# EasyEDA Pro project OpenHaldexC6-V1.1_2026-01-01.epro, schematic Haldex C6 V1.0

## Sheets
1 Power +USB: Board Name: Haldex C6 V1.0; Create Date: 2025-11-26; Page Name: Power +USB; Project Name: OpenHaldexC6-V1.1; Schematic Name: Haldex C6 V1.0; Update Date: 2025-11-27; Company: EasyEDA.com; Page Size: A4; Version: V1.0
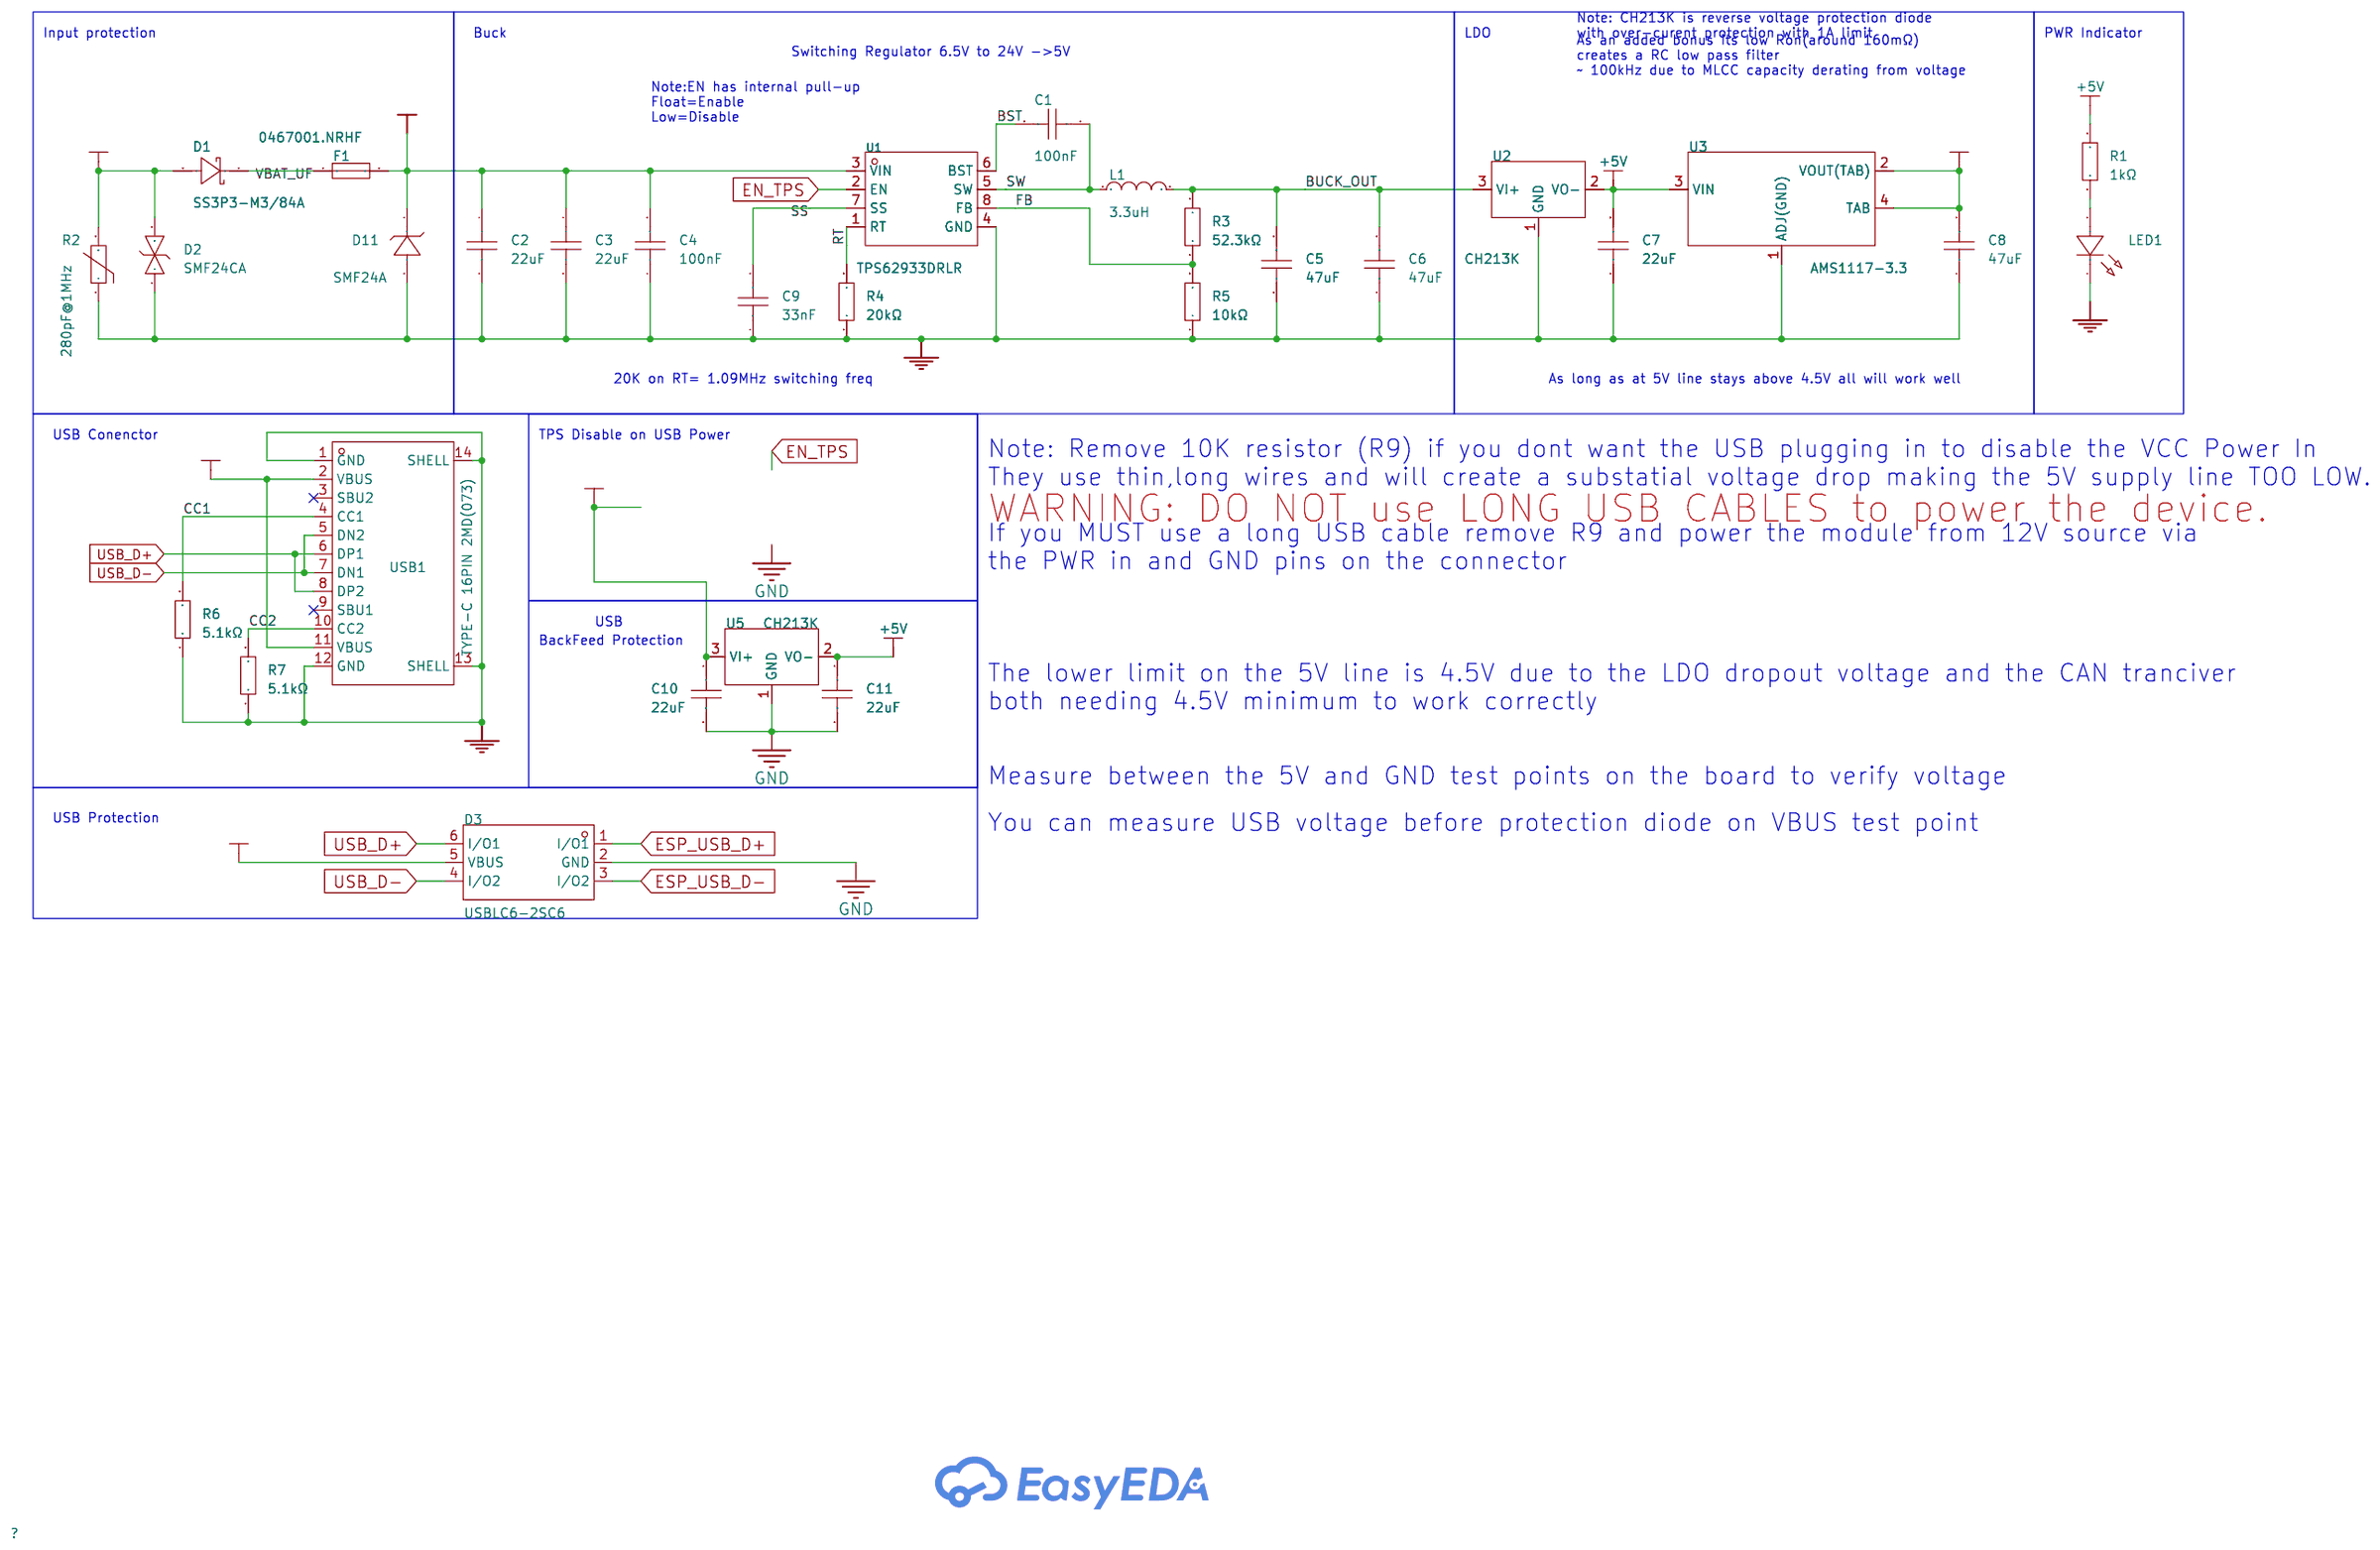
[diagram p0: Power +USB]
2 Conn, Input + Output: Page Name: Conn, Input + Output
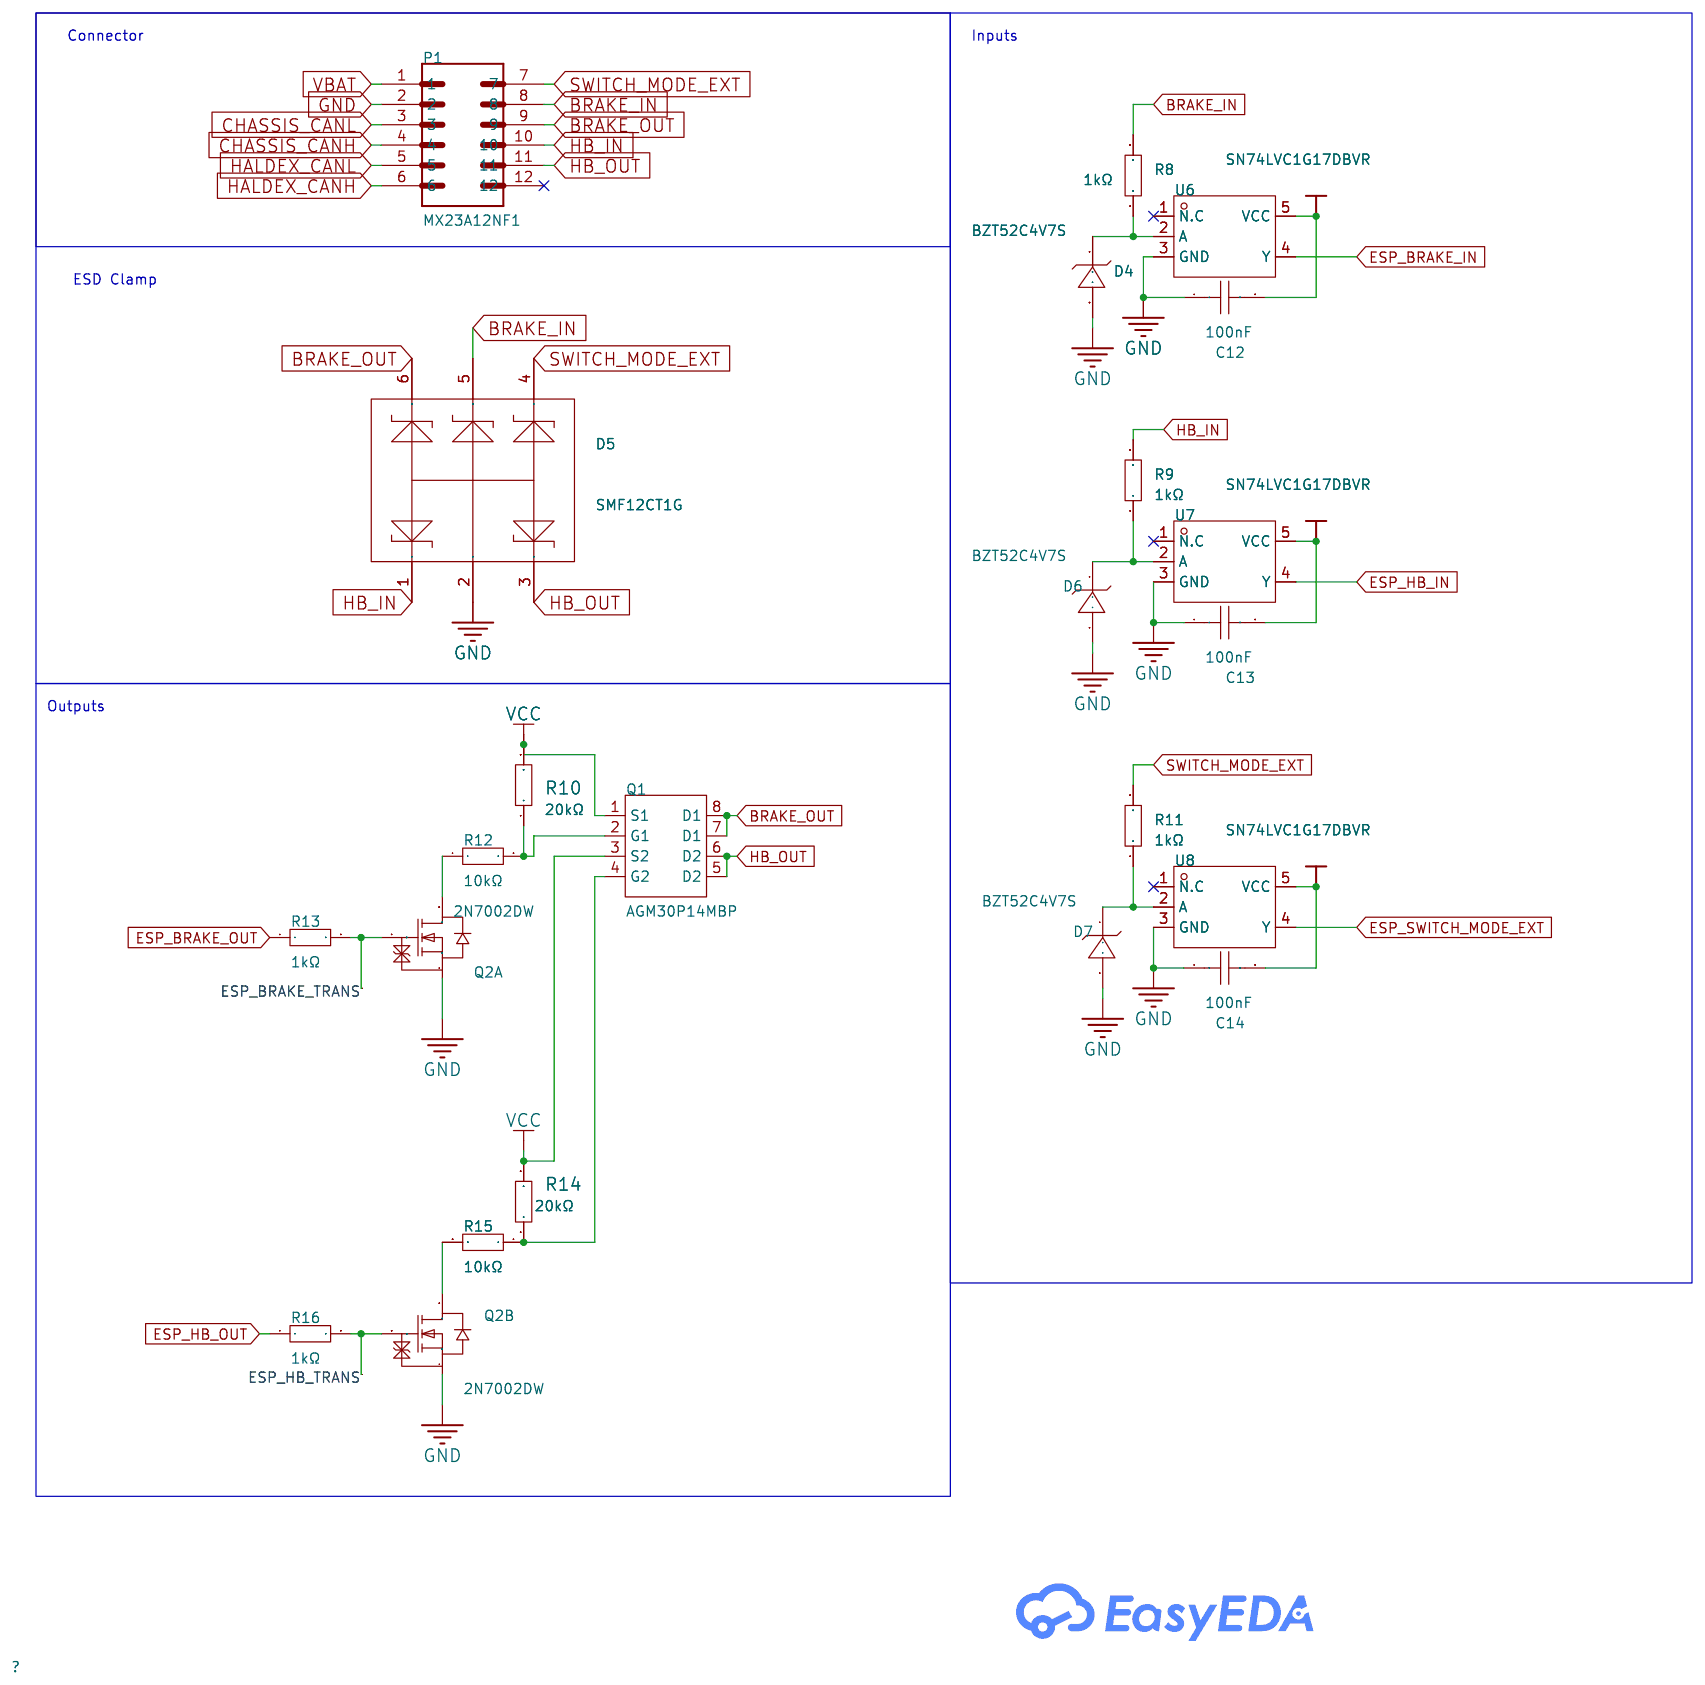
[diagram p1: Conn, Input + Output]
3 MCU + CANBUS: Page Name: MCU + CANBUS
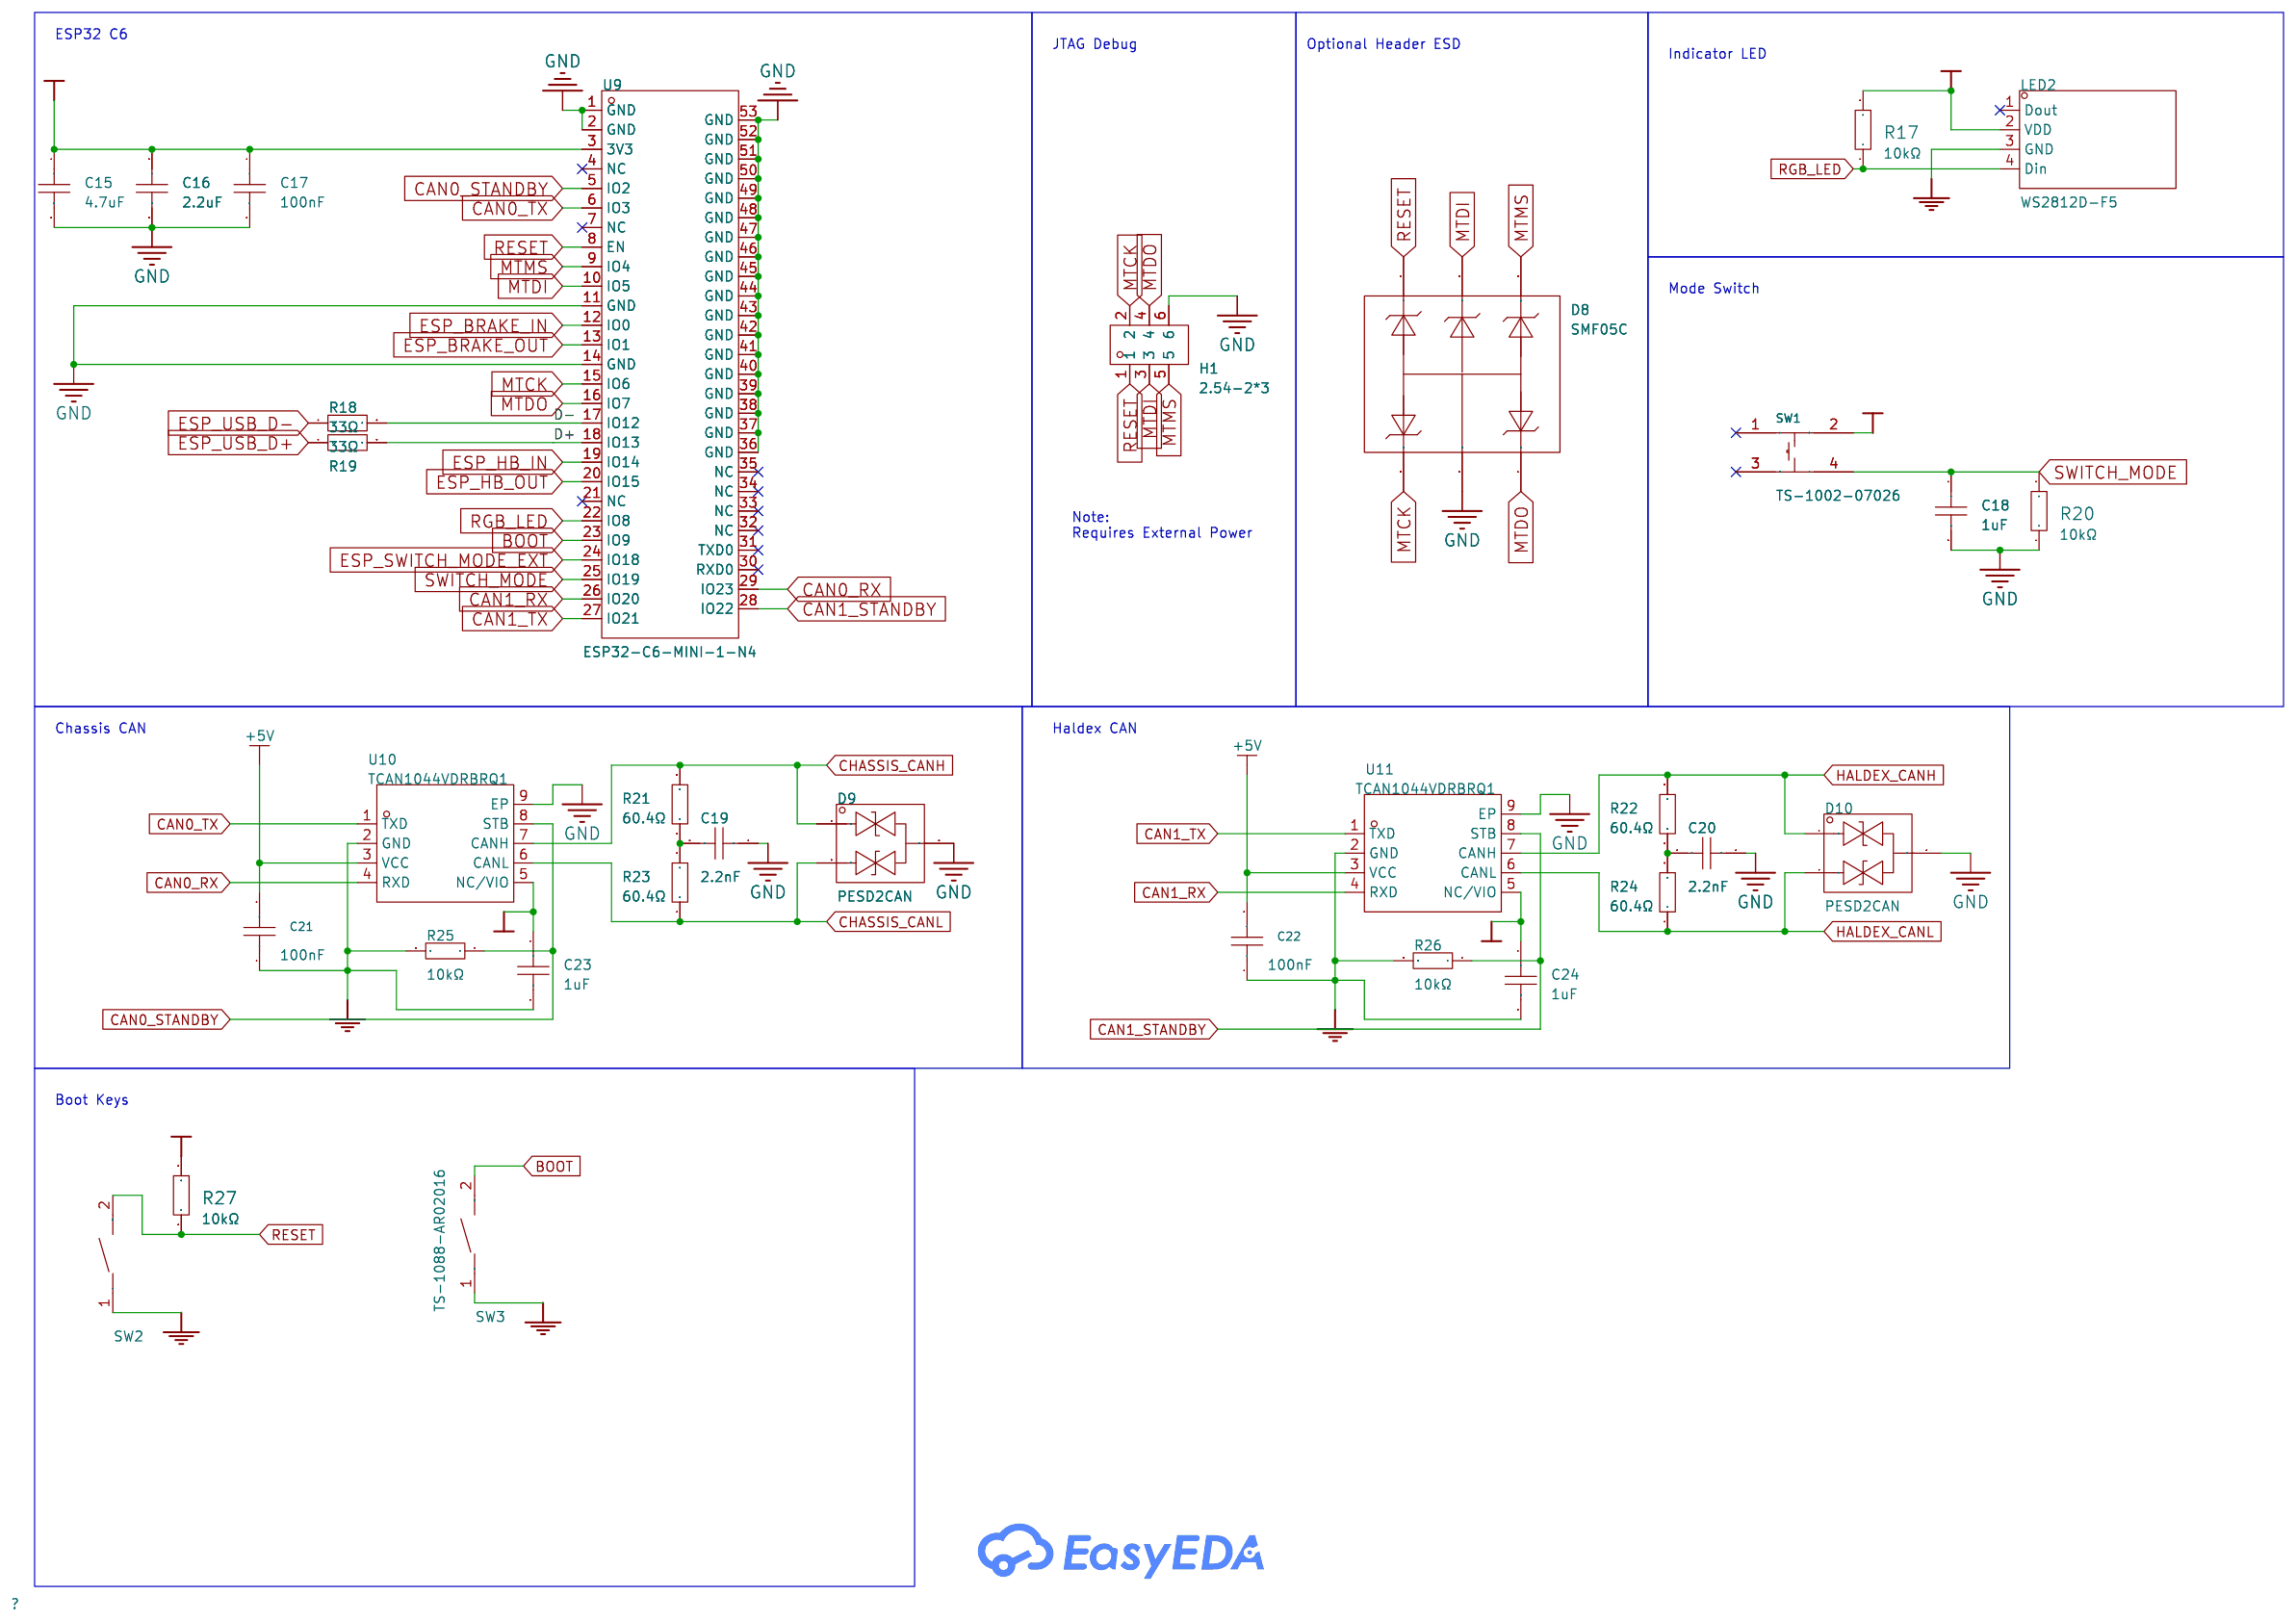
[diagram p2: MCU + CANBUS]

## Parts
sheet Conn, Input + Output
C12  100nF  [C0603]
C13  100nF  [C0603]
C14  100nF  [C0603]
D4  BZT52C4V7S  [SOD-323_L1.8-W1.3-LS2.5-RD]
D5  SMF12CT1G  [SOT-363_L2.0-W1.3-P0.65-LS2.1-BR]
D6  BZT52C4V7S  [SOD-323_L1.8-W1.3-LS2.5-RD]
D7  BZT52C4V7S  [SOD-323_L1.8-W1.3-LS2.5-RD]
P1  MX23A12NF1  [COON-TH_MX23A12NF1]
Q1  AGM30P14MBP  [DFN-8_L3.2-W3.1-P0.65-LS3.4-BL-1]
Q2  2N7002DW  [SOT-363-6_L2.0-W1.3-P0.65-LS2.1-BL]  (sections 1,2)
R8  1kΩ  [R0603]
R9  1kΩ  [R0603]
R10  20kΩ  [R0603]
R11  1kΩ  [R0603]
R12  10kΩ  [R0603]
R13  1kΩ  [R0603]
R14  20kΩ  [R0603]
R15  10kΩ  [R0603]
R16  1kΩ  [R0603]
U6  SN74LVC1G17DBVR  [SOT-23-5_L3.0-W1.5-P0.95-LS2.8-BL]
U7  SN74LVC1G17DBVR  [SOT-23-5_L3.0-W1.5-P0.95-LS2.8-BL]
U8  SN74LVC1G17DBVR  [SOT-23-5_L3.0-W1.5-P0.95-LS2.8-BL]
sheet MCU + CANBUS
C15  4.7uF  [C0603]
C16  2.2uF  [C0603]
C17  100nF  [C0603]
C18  1uF  [C0603]
C19  2.2nF  [C0603]
C20  2.2nF  [C0603]
C21  100nF  [C0603]
C22  100nF  [C0603]
C23  1uF  [C0603]
C24  1uF  [C0603]
D8  SMF05C  [SC-70-6_L2.0-W1.3-P0.65-LS2.1-BR]
D9  PESD2CAN  [SOT-23-3_L2.9-W1.3-P1.90-LS2.4-BR]
D10  PESD2CAN  [SOT-23-3_L2.9-W1.3-P1.90-LS2.4-BR]
H1  2.54-2*3  [HDR-TH_6P-P2.54-V-R2-C3-S2.54_A2541WV-2X3P]
LED2  WS2812D-F5  [LED-TH_4P-BD5.8-P1.30]
R17  10kΩ  [R0603]
R18  33Ω  [R0603]
R19  33Ω  [R0603]
R20  10kΩ  [R0603]
R21  60.4Ω  [R0603]
R22  60.4Ω  [R0603]
R23  60.4Ω  [R0603]
R24  60.4Ω  [R0603]
R25  10kΩ  [R0603]
R26  10kΩ  [R0603]
R27  10kΩ  [R0603]
SW1  TS-1002-07026  [SW-TH_4P-L6.0-W6.0-P4.50-LS6.5]
SW2  TS-1088-AR02016  [SW-SMD_L3.9-W3.0-P4.45]
SW3  TS-1088-AR02016  [SW-SMD_L3.9-W3.0-P4.45]
U9  ESP32-C6-MINI-1-N4  [WIFIM-SMD_61P-L16.6-W13.2-P0.80-ESP32-C6-MINI-1-N4]
U10  TCAN1044VDRBRQ1  [VSON-8_L3.0-W3.0-P0.65-BR-EP]
U11  TCAN1044VDRBRQ1  [VSON-8_L3.0-W3.0-P0.65-BR-EP]
sheet Power +USB
C1  100nF  [C0603]
C2  22uF  [C0805]
C3  22uF  [C0805]
C4  100nF  [C0603]
C5  47uF  [C0805]
C6  47uF  [C0805]
C7  22uF  [C0805]
C8  47uF  [C0805]
C9  33nF  [C0603]
C10  22uF  [C0805]
C11  22uF  [C0805]
D1  SS3P3-M3/84A  [DO-220AA_L3.4-W2.0-LS3.9-RD]
D2  SMF24CA  [SOD-123FL_L2.8-W1.8-LS3.7-BI]
D3  USBLC6-2SC6  [SOT-23-6_L2.9-W1.6-P0.95-LS2.8-BL]
D11  SMF24A  [SOD-123FL_L2.7-W1.8-LS3.8-RD]
F1  0467001.NRHF  [F0603]
L1  3.3uH  [IND-SMD_L5.4-W5.2_RS0530]
LED1  XL-1608UGC-04  [LED0603-RD_GREEN]
R1  1kΩ  [R0603]
R2  280pF@1MHz  [R0805]
R3  52.3kΩ  [R0603]
R4  20kΩ  [R0603]
R5  10kΩ  [R0603]
R6  5.1kΩ  [R0603]
R7  5.1kΩ  [R0603]
U1  TPS62933DRLR  [SOT-583-8_L2.1-W1.2-P0.50-LS1.6-BR]
U2  CH213K  [SOT-23-3_L2.9-W1.6-P1.90-LS2.8-BR]
U3  AMS1117-3.3  [SOT-223-4_L6.5-W3.5-P2.30-LS7.0-BR]
U5  CH213K  [SOT-23-3_L2.9-W1.6-P1.90-LS2.8-BR]
USB1  TYPE-C 16PIN 2MD(073)  [USB-C-SMD_TYPE-C-6PIN-2MD-073]

## Library data of the parts
C1 C4 C12-C14 C17 C21 C22 = CL10B104KB8NNNC: Capacitance:100nF Tolerance:±10% Tolerance:±10% Voltage Rating:50V Temperature Coefficient:X7R; LCSC Part Name: 100nF ±10% 50V; Supplier Part: C1591; Manufacturer: SAMSUNG(三星); Supplier Footprint: 0603; JLCPCB Part Class: Extended Part; Datasheet: https://item.szlcsc.com/datasheet/CL10B104KB8NNNC/1943.html; Supplier: LCSC; Tolerance: ±10%; Voltage Rating: 50V; Temperature Coefficient: X7R
D4 D6 D7 = BZT52C4V7S_C353517: Diode Configuration:Independent Zener Voltage(Nom):4.7V Reverse Leakage Current (Ir):3uA@2V Zener Voltage(Range):4.4V~5V Zener Voltage(Range):4.4V~5V Pd - Power Dissipation:200mW Impedance(Zzt):80Ω Operating Junction Temperature Range:-55℃~+150℃ Operating; LCSC Part Name: 独立式 耐压:4.7V 电流:3uA@2V; Supplier Part: C353517; Manufacturer: 晶导微电子; Supplier Footprint: SOD-323; JLCPCB Part Class: Extended Part; Datasheet: https://item.szlcsc.com/datasheet/BZT52C4V7S/329266.html; Supplier: LCSC; Diode Configuration: Independent; Zener Voltage(Nom): 4.7V; Reverse Leakage Current (Ir): 3uA@2V; Zener Voltage(Range): 4.4V~5V; Pd - Power Dissipation: 200mW; Impedance(Zzt): 80Ω; Operating Junction Temperature Range: -55℃~+150℃
D5 = SMF12CT1G_1: Reverse Stand-Off Voltage (Vrwm):12V Clamping Voltage:28V Peak Pulse Current (Ipp):5A@8/20us Peak Pulse Power Dissipation (Ppp):150W@8/20us Voltage - Breakdown:13.5V Reverse Leakage Current (Ir):100nA Number of Channels:5 level of protection:IEC 61000-4-4; LCSC Part Name: 12V截止 峰值浪涌电流：5A@8/20us; Supplier Part: C2999118; Manufacturer: TECH PUBLIC(台舟); Supplier Footprint: SOT-363; JLCPCB Part Class: Extended Part; Datasheet: https://item.szlcsc.com/datasheet/SMF12CT1G/3475165.html; Supplier: LCSC; Reverse Stand-Off Voltage (Vrwm): 12V; Clamping Voltage: 28V; Peak Pulse Current (Ipp): 5A@8/20us; Peak Pulse Power Dissipation (Ppp): 150W@8/20us; Voltage - Breakdown: 13.5V; Reverse Leakage Current (Ir): 100nA; Number of Channels: 5; level of protection: IEC 61000-4-4；IEC 61000-4-5；IEC 61000-4-2; Junction Capacitance: 20pF
P1 = MX23A12NF1: Supplier Part: C5359486; Manufacturer: JAE(日本航空电子); JLCPCB Part Class: Extended Part; Datasheet: https://atta.szlcsc.com/upload/public/pdf/source/20230330/B7F7CF0886F51BD2154D3E2774694052.pdf; Supplier: LCSC
Q1 = AGM30P14MBP: Number:2 P-Channel Drain to Source Voltage:30V Current - Continuous Drain(Id):21A RDS(on):12.3mΩ@10V Pd - Power Dissipation:30W Gate Threshold Voltage (Vgs(th)):1.5V@250uA Gate Charge(Qg):14nC@10V Input Capacitance(Ciss):1.35nF Reverse Transfer Capacitanc; LCSC Part Name: 2个P沟道 耐压:30V 电流:21A; Supplier Part: C5367089; Manufacturer: AGMSEMI(芯控源); Supplier Footprint: PDFN-8(3.3x3.3); JLCPCB Part Class: Extended Part; Datasheet: https://item.szlcsc.com/datasheet/AGM30P14MBP/6204015.html; Supplier: LCSC; Number: 2 P-Channel; Drain to Source Voltage: 30V; Current - Continuous Drain(Id): 21A; RDS(on): 12.3mΩ@10V; Pd - Power Dissipation: 30W; Gate Threshold Voltage (Vgs(th)): 1.5V@250uA; Gate Charge(Qg): 14nC@10V; Input Capacitance(Ciss): 1.35nF; Reverse Transfer Capacitance (Crss@Vds): 158pF; Operating Temperature: -55℃~+150℃; Output Capacitance(Coss): 194pF
Q2 = 2N7002DW_C5190214: Number:2 N-Channel Drain to Source Voltage:60V Current - Continuous Drain(Id):300mA RDS(on):1.9Ω@10V,0.3A Pd - Power Dissipation:300mW Gate Threshold Voltage (Vgs(th)):2.5V Gate Charge(Qg):650pC@30V Input Capacitance(Ciss):12pF@30V Reverse Transfer Capaci; LCSC Part Name: 双N沟道,电流:300mA,耐压:60V; Supplier Part: C5190214; Manufacturer: Hottech(合科泰); Supplier Footprint: SOT-363; Datasheet: https://item.szlcsc.com/datasheet/2N7002DW/5870820.html; Supplier: LCSC; Number: 2 N-Channel; Drain to Source Voltage: 60V; Current - Continuous Drain(Id): 300mA; RDS(on): 1.9Ω@10V,0.3A; Pd - Power Dissipation: 300mW; Gate Threshold Voltage (Vgs(th)): 2.5V; Gate Charge(Qg): 650pC@30V; Input Capacitance(Ciss): 12pF@30V; Operating Temperature: -50℃~+150℃
R8 R9 R11 = 0603WAF1001T5E: Type:Thick Film Resistors Resistance:1kΩ Tolerance:±1% Tolerance:±1% Power(Watts): Overload Voltage (Max): Temperature Coefficient:±100ppm/℃ Temperature Coefficient:±100ppm/℃ Operating Temperature Range:-55℃~+155℃ Operating Temperature Range:-55℃~+155℃; LCSC Part Name: 1kΩ ±1% 100mW 厚膜电阻; Supplier Part: C21190; Manufacturer: UNI-ROYAL(厚声); Supplier Footprint: 0603; JLCPCB Part Class: Basic Part; Datasheet: https://atta.szlcsc.com/upload/public/pdf/source/20200306/C422600_1E6D84923E4A46A82E41ADD87F860B5C.pdf; Supplier: LCSC; Type: Thick Film Resistors; Tolerance: ±1%; Temperature Coefficient: ±100ppm/℃; Operating Temperature Range: -55℃~+155℃; Check: true
R4 R10 R14 = 0603WAF2002T5E: Type:Thick Film Resistor Resistance:20kΩ Tolerance:±1% Tolerance:±1% Power(Watts):100mW Voltage-Supply(Max):75V Temperature Coefficient:±100ppm/℃ Temperature Coefficient:±100ppm/℃ Operating Temperature:-55℃~+155℃ Operating Temperature:-55℃~+155℃; LCSC Part Name: 20kΩ ±1% 100mW 厚膜电阻; Supplier Part: C4184; Manufacturer: UNI-ROYAL(厚声); Supplier Footprint: 0603; JLCPCB Part Class: Basic Part; Datasheet: https://item.szlcsc.com/datasheet/0603WAF2002T5E/4591.html; Supplier: LCSC; Type: Thick Film Resistor; Tolerance: ±1%; Power(Watts): 100mW; Voltage-Supply(Max): 75V; Temperature Coefficient: ±100ppm/℃; Operating Temperature: -55℃~+155℃
R5 R12 R15 R25 R26 = 0603WAF1002T5E: Type:Thick Film Resistor Resistance:10kΩ Tolerance:±1% Tolerance:±1% Power(Watts):100mW Voltage-Supply(Max):75V Temperature Coefficient:±100ppm/℃ Temperature Coefficient:±100ppm/℃ Operating Temperature:-55℃~+155℃ Operating Temperature:-55℃~+155℃; LCSC Part Name: 厚膜电阻 10kΩ ±1% 100mW; Supplier Part: C25804; Manufacturer: UNI-ROYAL(厚声); Supplier Footprint: 0603; JLCPCB Part Class: Basic Part; Datasheet: https://item.szlcsc.com/datasheet/0603WAF1002T5E/26547.html; Supplier: LCSC; Type: Thick Film Resistor; Tolerance: ±1%; Power(Watts): 100mW; Voltage-Supply(Max): 75V; Temperature Coefficient: ±100ppm/℃; Operating Temperature: -55℃~+155℃
R1 R13 R16 = 0603WAF1001T5E: Type:Thick Film Resistors Resistance:1kΩ Tolerance:±1% Tolerance:±1% Power(Watts): Overload Voltage (Max): Temperature Coefficient:±100ppm/℃ Temperature Coefficient:±100ppm/℃ Operating Temperature Range:-55℃~+155℃ Operating Temperature Range:-55℃~+155℃; LCSC Part Name: 1kΩ ±1% 100mW 厚膜电阻; Supplier Part: C21190; Manufacturer: UNI-ROYAL(厚声); Supplier Footprint: 0603; JLCPCB Part Class: Basic Part; Datasheet: https://atta.szlcsc.com/upload/public/pdf/source/20200306/C422600_1E6D84923E4A46A82E41ADD87F860B5C.pdf; Supplier: LCSC; Type: Thick Film Resistors; Tolerance: ±1%; Temperature Coefficient: ±100ppm/℃; Operating Temperature Range: -55℃~+155℃
U6-U8 = SN74LVC1G17DBVR_C19829662: Supplier Part: C19829662; Manufacturer: TECH PUBLIC(台舟); Supplier Footprint: SOT-23-5; JLCPCB Part Class: Extended Part; Datasheet: https://atta.szlcsc.com/upload/public/pdf/source/20240202/EAF8B4F29332307745EEFE11873F995E.pdf; Supplier: LCSC
C15 = CL10A475KP8NNNC: Capacitance:4.7uF Tolerance:±10% Tolerance:±10% Voltage Rating:10V Temperature Coefficient:X5R; LCSC Part Name: 4.7uF ±10% 10V; Supplier Part: C1705; Manufacturer: SAMSUNG(三星); Supplier Footprint: 0603; JLCPCB Part Class: Extended Part; Datasheet: https://item.szlcsc.com/datasheet/CL10A475KP8NNNC/2057.html; Supplier: LCSC; Tolerance: ±10%; Voltage Rating: 10V; Temperature Coefficient: X5R
C16 = CL10A225KO8NNNC: Capacitance:2.2uF Tolerance:±10% Tolerance:±10% Voltage Rating:16V Temperature Coefficient:X5R; LCSC Part Name: 2.2uF ±10% 16V; Supplier Part: C23630; Manufacturer: SAMSUNG(三星); Supplier Footprint: 0603; JLCPCB Part Class: Basic Part; Datasheet: https://item.szlcsc.com/datasheet/CL10A225KO8NNNC/24366.html; Supplier: LCSC; Tolerance: ±10%; Voltage Rating: 16V; Temperature Coefficient: X5R
C18 C23 C24 = CL10B105KB8NQNC: Capacitance:1uF Tolerance:±10% Tolerance:±10% Voltage Rating:50V Temperature Coefficient:X7R; LCSC Part Name: 1uF ±10% 50V; Supplier Part: C5199872; Manufacturer: SAMSUNG(三星); Supplier Footprint: 0603; JLCPCB Part Class: Extended Part; Datasheet: https://item.szlcsc.com/datasheet/CL10B105KB8NQNC/5885909.html; Supplier: LCSC; Tolerance: ±10%; Voltage Rating: 50V; Temperature Coefficient: X7R
C19 C20 = CL10C222JB8NNNC: Capacitance:2.2nF Tolerance:±5% Tolerance:±5% Voltage Rating:50V Temperature Coefficient:C0G; LCSC Part Name: 2.2nF ±5% 50V; Supplier Part: C33353; Manufacturer: SAMSUNG(三星); Supplier Footprint: 0603; JLCPCB Part Class: Extended Part; Datasheet: https://item.szlcsc.com/datasheet/CL10C222JB8NNNC/34318.html; Supplier: LCSC; Tolerance: ±5%; Voltage Rating: 50V; Temperature Coefficient: C0G
D8 = SMF05C_C558425: Polarity:Unidirectional Reverse Stand-Off Voltage (Vrwm):5V Clamping Voltage:12V Peak Pulse Current (Ipp):10A@8/20us Peak Pulse Power Dissipation (Ppp):200W@8/20us Voltage - Breakdown:6V Reverse Leakage Current (Ir):100nA Number of Channels:5 Operating Te; LCSC Part Name: MSL=3; Supplier Part: C558425; Manufacturer: TECH PUBLIC(台舟); Supplier Footprint: SOT-363; JLCPCB Part Class: Extended Part; Datasheet: https://item.szlcsc.com/datasheet/SMF05C/581832.html; Supplier: LCSC; Polarity: Unidirectional; Reverse Stand-Off Voltage (Vrwm): 5V; Clamping Voltage: 12V; Peak Pulse Current (Ipp): 10A@8/20us; Peak Pulse Power Dissipation (Ppp): 200W@8/20us; Voltage - Breakdown: 6V; Reverse Leakage Current (Ir): 100nA; Number of Channels: 5; Operating Temperature: -55℃~+125℃; level of protection: IEC 61000-4-2；IEC 61000-4-4；IEC 61000-4-5; Type: ESD; Junction Capacitance: 80pF
D9 D10 = PESD2CAN: Reverse Stand-Off Voltage (Vrwm):24V Clamping Voltage:54V Peak Pulse Current (Ipp):8A@8/20us Voltage - Breakdown:26.7V Type:TVS; Supplier Part: C284078; Manufacturer: DOWO(东沃); Supplier Footprint: SOT-23; JLCPCB Part Class: Extended Part; Datasheet: https://item.szlcsc.com/datasheet/PESD2CAN/269579.html; Supplier: LCSC; Reverse Stand-Off Voltage (Vrwm): 24V; Clamping Voltage: 54V; Peak Pulse Current (Ipp): 8A@8/20us; Voltage - Breakdown: 26.7V; Type: TVS
H1 = 2.54-2*3: Pin Structure:2x3P Pitch:2.54mm Row Spacing:2.54mm Circluar Pins/Square Pins:Pin Header Mounting Type:Through Hole Number of Rows:2 Number of Pins:6P Current Rating:2.5A Length of Mating Pin:6mm Insulation Height:2.54mm Length of End Connection Pin:3mm Co; LCSC Part Name: 2x3P 间距:2.54mm 方针 直插; Supplier Part: C5116479; Manufacturer: ZHOURI(洲日); Supplier Footprint: 插件,P=2.54mm; JLCPCB Part Class: Extended Part; Datasheet: https://item.szlcsc.com/datasheet/2.54-2*3/5692722.html; Supplier: LCSC; Pin Structure: 2x3P; Pitch: 2.54mm; Row Spacing: 2.54mm; Circluar Pins/Square Pins: Pin Header; Mounting Type: Through Hole; Number of Rows: 2; Number of Pins: 6P; Current Rating: 2.5A; Length of Mating Pin: 6mm; Insulation Height: 2.54mm; Length of End Connection Pin: 3mm; Contact Material: Brass; Contact Plating: Gold; Operating Temperature: -40℃~+105℃
LED2 = WS2812D-F5: Wavelength:R:620nm~625nm；B:465nm~470nm；G:520nm~525nm Luminous Intensity:G:4000mcd；R:3000mcd；B:2500mcd Fixed-Frequency Pwm Mode:2kHz Data Transmission Rate:800Kbit/s Voltage - Supply:3.7V~5.3V Voltage - Supply:3.7V~5.3V Operating Temperature:-25℃~+85℃ Peak; LCSC Part Name: 智能控制通孔式LED集成光源; Supplier Part: C190565; Manufacturer: worldsemi; Supplier Footprint: 插件,D=5mm; JLCPCB Part Class: Extended Part; Datasheet: https://item.szlcsc.com/datasheet/WS2812D-F5/211094.html; Supplier: LCSC; Wavelength: R:620nm~625nm；B:465nm~470nm；G:520nm~525nm; Luminous Intensity: G:4000mcd；R:3000mcd；B:2500mcd; Fixed-Frequency Pwm Mode: 2kHz; Data Transmission Rate: 800Kbit/s; Voltage - Supply: 3.7V~5.3V; Operating Temperature: -25℃~+85℃; Peak Wavelength: G:522.5nm；R:622.5nm；B:467.5nm
R17 R20 R27 = 0603WAF1002T5E: Type:Thick Film Resistor Resistance:10kΩ Tolerance:±1% Tolerance:±1% Power(Watts):100mW Voltage-Supply(Max):75V Temperature Coefficient:±100ppm/℃ Temperature Coefficient:±100ppm/℃ Operating Temperature:-55℃~+155℃ Operating Temperature:-55℃~+155℃; LCSC Part Name: 厚膜电阻 10kΩ ±1% 100mW; Supplier Part: C25804; Manufacturer: UNI-ROYAL(厚声); Supplier Footprint: 0603; JLCPCB Part Class: Basic Part; Datasheet: https://atta.szlcsc.com/upload/public/pdf/source/20200306/C422600_1E6D84923E4A46A82E41ADD87F860B5C.pdf; Supplier: LCSC; Type: Thick Film Resistor; Tolerance: ±1%; Power(Watts): 100mW; Voltage-Supply(Max): 75V; Temperature Coefficient: ±100ppm/℃; Operating Temperature: -55℃~+155℃
R18 R19 = 0603WAF330JT5E: Type:Thick Film Resistor Resistance:33Ω Tolerance:±1% Tolerance:±1% Power(Watts):100mW Voltage-Supply(Max):75V Temperature Coefficient:±100ppm/℃ Temperature Coefficient:±100ppm/℃ Operating Temperature:-55℃~+155℃ Operating Temperature:-55℃~+155℃; LCSC Part Name: 33Ω ±1% 100mW 厚膜电阻; Supplier Part: C23140; Manufacturer: UNI-ROYAL(厚声); Supplier Footprint: 0603; JLCPCB Part Class: Basic Part; Datasheet: https://item.szlcsc.com/datasheet/0603WAF330JT5E/23867.html; Supplier: LCSC; Type: Thick Film Resistor; Tolerance: ±1%; Power(Watts): 100mW; Voltage-Supply(Max): 75V; Temperature Coefficient: ±100ppm/℃; Operating Temperature: -55℃~+155℃
R21-R24 = RC0603FR-0760R4L: Type:Thick Film Resistors Resistance: Tolerance:±1% Tolerance:±1% Power(Watts): Overload Voltage (Max): Temperature Coefficient:±100ppm/℃ Temperature Coefficient:±100ppm/℃ Operating Temperature Range:-55℃~+155℃ Operating Temperature Range:-55℃~+155℃; LCSC Part Name: 厚膜电阻 60.4Ω ±1% 100mW; Supplier Part: C245987; Manufacturer: YAGEO(国巨); Supplier Footprint: 0603; JLCPCB Part Class: Extended Part; Datasheet: https://atta.szlcsc.com/upload/public/pdf/source/20180821/C275644_0D56F95EFF785E7D9A1FEF436B37DA78.pdf; Supplier: LCSC; Type: Thick Film Resistors; Tolerance: ±1%; Temperature Coefficient: ±100ppm/℃; Operating Temperature Range: -55℃~+155℃
SW1 = TS-1002-07026: Circuit:SPST Actuator Style:Round Button Mounting Type:Through Hole Length:6mm Width:6mm Switch Height:7mm Contact Current:50mA Voltage Rating:12V With Lamp:- Life:-; LCSC Part Name: 6*6*7mm 直插 轻触开关; Supplier Part: C455095; Manufacturer: XUNPU(讯普); Supplier Footprint: 插件,6x6mm; JLCPCB Part Class: Extended Part; Datasheet: https://item.szlcsc.com/datasheet/TS-1002-07026/457500.html; Supplier: LCSC; Circuit: SPST; Actuator Style: Round Button; Mounting Type: Through Hole; Length: 6mm; Width: 6mm; Switch Height: 7mm; Contact Current: 50mA; Voltage Rating: 12V
SW2 SW3 = TS-1088-AR02016: Circuit:SPST Actuator Style:Round Button Operating Force:1.6N Mounting Type:Surface Mount,Vertical Length:4mm Width:3mm Switch Height:2mm with Bracket:Without Bracket Contact Current:50mA Voltage Rating:12V Actuator/Cap Color:Black Termination Style:SMD(S; LCSC Part Name: 4*3*2mm 立贴 轻触开关; Supplier Part: C720477; Manufacturer: XUNPU(讯普); Supplier Footprint: SMD; JLCPCB Part Class: Basic Part; Datasheet: https://item.szlcsc.com/datasheet/TS-1088-AR02016/763484.html; Supplier: LCSC; Circuit: SPST; Actuator Style: Round Button; Operating Force: 1.6N; Mounting Type: Surface Mount,Vertical; Length: 4mm; Width: 3mm; Switch Height: 2mm; with Bracket: Without Bracket; Contact Current: 50mA; Voltage Rating: 12V; Actuator/Cap Color: Black; Termination Style: SMD(SMT) Tab; Life: 100,000 Cycles; Operating Temperature: -30℃~+80℃
U9 = ESP32-C6-MINI-1-N4: Supplier Part: C5736265; Manufacturer: ESPRESSIF(乐鑫); Supplier Footprint: SMD-53P; JLCPCB Part Class: Extended Part; Datasheet: https://item.szlcsc.com/datasheet/ESP32-C6-MINI-1-N4/6661848.html; Supplier: LCSC
U10 U11 = TCAN1044VDRBRQ1: Type:CAN FD Transceiver Data Rate:8Mbps Voltage - Supply:4.5V~5.5V Voltage - Supply:4.5V~5.5V Operating Temperature:-40℃~+125℃ Operating Temperature:-40℃~+125℃; LCSC Part Name: 具有待机和 1.8V I/O 支持的汽车类故障保护高速 CAN 收发器; Supplier Part: C5215851; Manufacturer: TI(德州仪器); Supplier Footprint: SON-8(3x3); JLCPCB Part Class: Extended Part; Datasheet: https://www.ti.com/cn/lit/gpn/tcan1044v-q1; Supplier: LCSC; Type: CAN FD Transceiver; Data Rate: 8Mbps; Voltage - Supply: 4.5V~5.5V; Operating Temperature: -40℃~+125℃
C2 C3 C7 C10 C11 = HGC0805R5226M350NSLJ: Capacitance: Tolerance:±20% Tolerance:±20% Voltage Rated: Temperature Coefficient:; LCSC Part Name: 22uF ±20% 35V; Supplier Part: C22367832; Manufacturer: Chinocera(华瓷); Supplier Footprint: 0805; JLCPCB Part Class: Extended Part; Datasheet: https://atta.szlcsc.com/upload/public/pdf/source/20240326/E9E9157D170E907C889ABA1F54A94302.pdf; Supplier: LCSC; Tolerance: ±20%; Standardization Check: false
C5 C6 C8 = CL21A476MPYNNWE: Capacitance:47uF Tolerance:±20% Tolerance:±20% Voltage Rating:10V Temperature Coefficient:X5R; LCSC Part Name: 47uF ±20% 10V; Supplier Part: C5596752; Manufacturer: SAMSUNG(三星); Supplier Footprint: 0805; JLCPCB Part Class: Extended Part; Datasheet: https://item.szlcsc.com/datasheet/CL21A476MPYNNWE/6515219.html; Supplier: LCSC; Tolerance: ±20%; Voltage Rating: 10V; Temperature Coefficient: X5R
C9 = CL10B333KB8NNNC: Capacitance:33nF Tolerance:±10% Tolerance:±10% Voltage Rating:50V Temperature Coefficient:X7R; LCSC Part Name: 33nF ±10% 50V; Supplier Part: C21117; Manufacturer: SAMSUNG(三星); Supplier Footprint: 0603; JLCPCB Part Class: Basic Part; Datasheet: https://item.szlcsc.com/datasheet/CL10B333KB8NNNC/21829.html; Supplier: LCSC; Tolerance: ±10%; Voltage Rating: 50V; Temperature Coefficient: X7R
D1 = SS3P3-M3/84A: Diode Configuration:Independent Voltage - Forward(Vf@If):520mV@3A Voltage - DC Reverse(Vr):30V Current - Rectified:3A Reverse Leakage Current (Ir):200uA@30V Operating Junction Temperature Range:-55℃~+150℃ Operating Junction Temperature Range:-55℃~+150℃ No; LCSC Part Name: 电压:30V 电流:3A; Supplier Part: C2920641; Manufacturer: VISHAY(威世); Supplier Footprint: DO-220AA; Datasheet: https://item.szlcsc.com/datasheet/SS3P3-M3%252F84A/3224886.html; Supplier: LCSC; Diode Configuration: Independent; Voltage - Forward(Vf@If): 520mV@3A; Voltage - DC Reverse(Vr): 30V; Current - Rectified: 3A; Reverse Leakage Current (Ir): 200uA@30V; Operating Junction Temperature Range: -55℃~+150℃; Non-Repetitive Peak Forward Surge Current: 50A
D2 = SMF24CA_C353294: Reverse Stand-Off Voltage (Vrwm):24V Maximum Clamping Voltage:38.9V Peak Pulse Current (Ipp)@10/1000us:5.1A Breakdown Voltage:26.7V Reverse Leakage Current (Ir):1uA Type:TVS; Supplier Part: C353294; Manufacturer: 晶导微电子; Supplier Footprint: SOD-123FL; JLCPCB Part Class: Extended Part; Datasheet: https://atta.szlcsc.com/upload/public/pdf/source/20201106/C438024_76561727B84E8C9F41A4B4461A8AA838.pdf; Supplier: LCSC; Reverse Stand-Off Voltage (Vrwm): 24V; Maximum Clamping Voltage: 38.9V; Peak Pulse Current (Ipp)@10/1000us: 5.1A; Breakdown Voltage: 26.7V; Reverse Leakage Current (Ir): 1uA; Type: TVS
D3 = USBLC6-2SC6_C2687116: Maximum Clamping Voltage:15V Breakdown Voltage:6V Number of Lines:双路 Type:ESD; Supplier Part: C2687116; Manufacturer: UMW(友台半导体); Supplier Footprint: SOT-23-6; JLCPCB Part Class: Extended Part; Datasheet: https://atta.szlcsc.com/upload/public/pdf/source/20231109/512642D850D9873E7C519F71E85B9A10.pdf; Supplier: LCSC; Maximum Clamping Voltage: 15V; Breakdown Voltage: 6V; Number of Lines: 双路; Type: ESD
D11 = SMF24A_C19077514: Polarity:Unidirectional Reverse Stand-Off Voltage (Vrwm):24V Clamping Voltage:38.9V Peak Pulse Current (Ipp):5.1A@10/1000us Peak Pulse Power Dissipation (Ppp):200W@10/1000us Voltage - Breakdown:29.5V Reverse Leakage Current (Ir):1uA Number of Channels:1.0; LCSC Part Name: 单向TVS 24V截止 峰值浪涌电流：5.1A@10/1000us; Supplier Part: C19077514; Manufacturer: R+O(宏嘉诚); Supplier Footprint: SOD-123FL; JLCPCB Part Class: Extended Part; Datasheet: https://item.szlcsc.com/datasheet/SMF24A/20275599.html; Supplier: LCSC; Polarity: Unidirectional; Reverse Stand-Off Voltage (Vrwm): 24V; Clamping Voltage: 38.9V; Peak Pulse Current (Ipp): 5.1A@10/1000us; Peak Pulse Power Dissipation (Ppp): 200W@10/1000us; Voltage - Breakdown: 29.5V; Reverse Leakage Current (Ir): 1uA; Number of Channels: 1; Operating Temperature: -55℃~+150℃; level of protection: IEC 61000-4-2; Type: TVS
F1 = 0467001.NRHF: Type:Surface Mount Fuse Current Rating:1A Voltage Rating (AC):32V Voltage Rating (DC):32V Operating Temperature:-55℃~+90℃ Operating Temperature:-55℃~+90℃ Melting I2t:0.0212 Interrupt Rating:50A; LCSC Part Name: 32V贴片式保险丝; Supplier Part: C151139; Manufacturer: Littelfuse(美国力特); Supplier Footprint: 0603; JLCPCB Part Class: Extended Part; Datasheet: https://item.szlcsc.com/datasheet/0467001.NRHF/162479.html; Supplier: LCSC; Type: Surface Mount Fuse; Current Rating: 1A; Voltage Rating (AC): 32V; Voltage Rating (DC): 32V; Operating Temperature: -55℃~+90℃; Melting I2t: 0.0212; Interrupt Rating: 50A
L1 = RS0530-3R3MS: Inductance: Tolerance:±20% Tolerance:±20% Rated Current: Current - Saturation (Isat):6A DC Resistance (DCR): Type:Integrated molded inductor; LCSC Part Name: 一体成型贴片电感; Supplier Part: C32712971; Manufacturer: Ruishen(瑞申电子); Supplier Footprint: SMD,5.4x5.2mm; JLCPCB Part Class: Extended Part; Datasheet: https://atta.szlcsc.com/upload/public/pdf/source/20240725/7B6EBB1A494949AC693F8F7680A8A98C.pdf; Supplier: LCSC; Tolerance: ±20%; Current - Saturation (Isat): 6A; Type: Integrated molded inductor
LED1 = XL-1608UGC-04: Lamp Holder Type:- Illumination Color:Emerald Green Voltage - Forward(Vf):3.3V Voltage - Forward(Vf):3.3V Power(Watts):70mW Forward Current:20mA Wavelength - Dominant:515nm~535nm Wavelength - Dominant:515nm~535nm Peak Wavelength:525nm Diode Configuration:; Supplier Part: C965804; Manufacturer: XINGLIGHT(成兴光); Supplier Footprint: 0603; JLCPCB Part Class: Extended Part; Datasheet: https://item.szlcsc.com/datasheet/XL-1608UGC-04/1051413.html; Supplier: LCSC; Illumination Color: Emerald Green; Voltage - Forward(Vf): 3.3V; Power(Watts): 70mW; Forward Current: 20mA; Wavelength - Dominant: 515nm~535nm; Peak Wavelength: 525nm; Diode Configuration: Discrete Diode; Lens Color: Water Clear; Luminous Intensity: 810mcd; Viewing Angle: 120°; Mounting Style: op View Mount
R2 = FPV201209E260PKT: Varistor Voltage:36V Varistor Voltage:36V Clamping Voltage:63V Maximum DC Volts:26V Maximum AC Volts:18.4V Peak Current:100A Energy:0.3J Energy:0.3J Capacitance:280pF@1MHz Rated Wattage:-; LCSC Part Name: 钳位电压63V 0.3焦耳 0805压敏电阻; Supplier Part: C2991545; Manufacturer: FH(风华); Supplier Footprint: 0805; JLCPCB Part Class: Extended Part; Datasheet: https://atta.szlcsc.com/upload/public/pdf/source/20181030/C304296_DDDABF933F96CAF6D0EBDDE0D30269D0.pdf; Supplier: LCSC; Varistor Voltage: 36V; Clamping Voltage: 63V; Maximum DC Volts: 26V; Maximum AC Volts: 18.4V; Peak Current: 100A; Energy: 0.3J
R3 = 0603WAF5232T5E: Type:Thick Film Resistor Resistance:52.3kΩ Tolerance:±1% Tolerance:±1% Power(Watts):100mW Voltage-Supply(Max):75V Temperature Coefficient:±100ppm/℃ Temperature Coefficient:±100ppm/℃ Operating Temperature:-55℃~+155℃ Operating Temperature:-55℃~+155℃; LCSC Part Name: 52.3kΩ ±1% 100mW 厚膜电阻; Supplier Part: C23198; Manufacturer: UNI-ROYAL(厚声); Supplier Footprint: 0603; JLCPCB Part Class: Extended Part; Datasheet: https://item.szlcsc.com/datasheet/0603WAF5232T5E/23925.html; Supplier: LCSC; Type: Thick Film Resistor; Tolerance: ±1%; Power(Watts): 100mW; Voltage-Supply(Max): 75V; Temperature Coefficient: ±100ppm/℃; Operating Temperature: -55℃~+155℃
R6 R7 = 0603WAF5101T5E: Type:Thick Film Resistor Resistance:5.1kΩ Tolerance:±1% Tolerance:±1% Power(Watts):100mW Voltage-Supply(Max):75V Temperature Coefficient:±100ppm/℃ Temperature Coefficient:±100ppm/℃ Operating Temperature:-55℃~+155℃ Operating Temperature:-55℃~+155℃; LCSC Part Name: 5.1kΩ ±1% 100mW 厚膜电阻; Supplier Part: C23186; Manufacturer: UNI-ROYAL(厚声); Supplier Footprint: 0603; JLCPCB Part Class: Basic Part; Datasheet: https://item.szlcsc.com/datasheet/0603WAF5101T5E/23913.html; Supplier: LCSC; Type: Thick Film Resistor; Tolerance: ±1%; Power(Watts): 100mW; Voltage-Supply(Max): 75V; Temperature Coefficient: ±100ppm/℃; Operating Temperature: -55℃~+155℃
U1 = TPS62933DRLR: Function:Step-down type Output Type:Adjustable Input Voltage:3.8V~30V Input Voltage:3.8V~30V Output Voltage:800mV~22V Output Voltage:800mV~22V Output Current (Max):3A Switching Frequency:2.2MHz Operating Temperature:-40℃~+150℃@(TJ) Operating Temperature:-; Supplier Part: C3200405; Manufacturer: TI(德州仪器); Supplier Footprint: SOT-583; JLCPCB Part Class: Extended Part; Datasheet: https://www.ti.com/cn/lit/gpn/tps62933; Supplier: LCSC; Function: Step-down type; Output Type: Adjustable; Input Voltage: 3.8V~30V; Output Voltage: 800mV~22V; Output Current (Max): 3A; Switching Frequency: 2.2MHz; Operating Temperature: -40℃~+150℃@(TJ); Synchronous Rectification: Yes; Number of Outputs: 1; Topology: Step-down; Switch tube (built-in/external): 内置; Standardization Check: false
U2 U5 = CH213K: Supplier Part: C5456874; Manufacturer: WCH(南京沁恒); Supplier Footprint: SOT-23-3; JLCPCB Part Class: Extended Part; Datasheet: https://item.szlcsc.com/datasheet/CH213K/6369803.html; Supplier: LCSC
U3 = AMS1117-3.3_C347222: Output Type:Fixed Voltage - Supply:12V Output Voltage:3.3V Output Voltage:3.3V Output Current:1A Power Supply Rejection Ratio (PSRR):60dB@(120Hz) Voltage Dropout:1.3V@(1A) standby current:- Noise:- Features:Overcurrent Protection Operating Temperature:- O; LCSC Part Name: 输出:3.3V 电流:1A 耐压:12V; Supplier Part: C347222; Manufacturer: UMW(友台半导体); Supplier Footprint: SOT-223; Datasheet: https://item.szlcsc.com/datasheet/AMS1117-3.3/323882.html; Supplier: LCSC; Output Type: Fixed; Voltage - Supply: 12V; Output Voltage: 3.3V; Output Current: 1A; Power Supply Rejection Ratio (PSRR): 60dB@(120Hz); Voltage Dropout: 1.3V@(1A); Features: Overcurrent Protection; Output Configuration: Positive electrode; Number of Outputs: 1
USB1 = TYPE-C 16PIN 2MD(073): Connector Type:Type-C Protocol Standard:- Gender:Female Mounting Type:Surface Mount, Right Angle Number of Contacts:16P Number of Ports:1 Current Rating-Power:3A Voltage Rating:5V Connect-Disconnect Life:5,000 Cycles Supplementary Features:- Center Height; LCSC Part Name: Type-C 母 卧贴; Supplier Part: C2765186; Manufacturer: SHOU HAN(首韩); Supplier Footprint: SMD; JLCPCB Part Class: Extended Part; Datasheet: https://item.szlcsc.com/datasheet/TYPE-C%252016PIN%25202MD(073)/2901843.html; Supplier: LCSC; Connector Type: Type-C; Gender: Female; Mounting Type: Surface Mount, Right Angle; Number of Contacts: 16P; Number of Ports: 1; Current Rating-Power: 3A; Voltage Rating: 5V; Connect-Disconnect Life: 5,000 Cycles; Detection color: Black; Operating Temperature: -25℃~+85℃

## Nets
+3.3V: C8.2 C12.2 C13.2 C14.2 C15.1 C16.1 C17.1 C23.1 C24.1 LED2.2(VDD) R17.2 R27.2 SW1.2 U3.2(VOUT(TAB)) U3.4(TAB) U6.5(VCC) U7.5(VCC) U8.5(VCC) U9.3(3V3) U10.5(NC/VIO) U11.5(NC/VIO)
+5V: C7.2 C11.1 C21.2 C22.2 R1.2 U2.2(VO-) U3.3(VIN) U5.2(VO-) U10.3(VCC) U11.3(VCC)
GND: C2.2 C3.2 C4.1 C5.1 C6.1 C7.1 C8.1 C9.1 C10.2 C11.2 C12.1 C13.1 C14.1 C15.2 C16.2 C17.2 C18.2 C19.1 C20.1 C21.1 C22.1 C23.2 C24.2 D2.1 D3.2(GND) D4.2(A) D5.2 D6.2(A) D7.2(A) D8.2 D9.3 D10.3 D11.2(A) H1.6 LED1.1(K) LED2.3(GND) P1.2 Q2.1(S1) Q2.4(S2) R2.1 R4.1 R5.1 R6.1 R7.1 R20.1 R25.2 R26.2 SW2.1 SW3.1 U1.4(GND) U2.1(GND) U3.1(ADJ(GND)) U5.1(GND) U6.3(GND) U7.3(GND) U8.3(GND) U9.1(GND) U9.2(GND) U9.11(GND) U9.14(GND) U9.36(GND) U9.37(GND) U9.38(GND) U9.39(GND) U9.40(GND) U9.41(GND) U9.42(GND) U9.43(GND) U9.44(GND) U9.45(GND) U9.46(GND) U9.47(GND) U9.48(GND) U9.49(GND) U9.50(GND) U9.51(GND) U9.52(GND) U9.53(GND) U10.2(GND) U10.9(EP) U11.2(GND) U11.9(EP) USB1.1(GND) USB1.12(GND) USB1.13(SHELL) USB1.14(SHELL)
VBAT: D1.2(A) D2.2 P1.1 R2.2
VBAT_UF: D1.1(C) F1.1
VBUS: C10.1 D3.5(VBUS) U5.3(VI+) USB1.2(VBUS) USB1.11(VBUS)
VCC: C2.1 C3.1 C4.2 D11.1(K) F1.2 Q1.1(S1) Q1.3(S2) R10.2 R14.2 U1.3(VIN)
BOOT: SW3.2 U9.23(IO9)
BRAKE_IN: D5.5 P1.8 R8.2
BRAKE_OUT: D5.6 P1.9 Q1.7(D1) Q1.8(D1)
BST: C1.2 U1.6(BST)
BUCK_OUT: C5.2 C6.2 L1.2 R3.2 U2.3(VI+)
CAN0_RX: U9.29(IO23) U10.4(RXD)
CAN0_STANDBY: R25.1 U9.5(IO2) U10.8(STB)
CAN0_TX: U9.6(IO3) U10.1(TXD)
CAN1_RX: U9.26(IO20) U11.4(RXD)
CAN1_STANDBY: R26.1 U9.28(IO22) U11.8(STB)
CAN1_TX: U9.27(IO21) U11.1(TXD)
CC1: R6.2 USB1.4(CC1)
CC2: R7.2 USB1.10(CC2)
CHASSIS_CANH: D9.1 P1.4 R21.2 U10.7(CANH)
CHASSIS_CANL: D9.2 P1.3 R23.1 U10.6(CANL)
D+: R19.2 U9.18(IO13)
D-: R18.2 U9.17(IO12)
EN_TPS: U1.2(EN)
ESP_BRAKE_IN: U6.4(Y) U9.12(IO0)
ESP_BRAKE_OUT: R13.1 U9.13(IO1)
ESP_BRAKE_TRANS: Q2.2(G1) R13.2
ESP_HB_IN: U7.4(Y) U9.19(IO14)
ESP_HB_OUT: R16.1 U9.20(IO15)
ESP_HB_TRANS: Q2.5(G2) R16.2
ESP_SWITCH_MODE_EXT: U8.4(Y) U9.24(IO18)
ESP_USB_D+: D3.1(I/O1) R19.1
ESP_USB_D-: D3.3(I/O2) R18.1
FB: R3.1 R5.2 U1.8(FB)
HALDEX_CANH: D10.1 P1.6 R22.2 U11.7(CANH)
HALDEX_CANL: D10.2 P1.5 R24.1 U11.6(CANL)
HB_IN: D5.1 P1.10 R9.2
HB_OUT: D5.3 P1.11 Q1.5(D2) Q1.6(D2)
MTCK: D8.3 H1.2 U9.15(IO6)
MTDI: D8.5 H1.3 U9.10(IO5)
MTDO: D8.1 H1.4 U9.16(IO7)
MTMS: D8.6 H1.5 U9.9(IO4)
RESET: D8.4 H1.1 R27.1 SW2.2 U9.8(EN)
RGB_LED: LED2.4(Din) R17.1 U9.22(IO8)
RT: R4.2 U1.1(RT)
SS: C9.2 U1.7(SS)
SW: C1.1 L1.1 U1.5(SW)
SWITCH_MODE: C18.1 R20.2 SW1.4 U9.25(IO19)
SWITCH_MODE_EXT: D5.4 P1.7 R11.2
USB_D+: D3.6(I/O1) USB1.6(DP1) USB1.8(DP2)
USB_D-: D3.4(I/O2) USB1.5(DN2) USB1.7(DN1)
$2N1005: LED1.2(A) R1.1
$3N1132: D6.1(K) R9.1 U7.2(A)
$3N1135: D4.1(K) R8.1 U6.2(A)
$3N1142: D7.1(K) R11.1 U8.2(A)
$3N1660: Q1.4(G2) R14.1 R15.1
$3N2481: Q2.3(D2) R15.2
$3N2546: Q2.6(D1) R12.1
$3N2561: Q1.2(G1) R10.1 R12.2
$4N2100: C20.2 R22.1 R24.2
$4N2133: C19.2 R21.1 R23.2

Not connected (* = marked no-connect by the designer): LED2 1(Dout)*; P1 12*; SW1 1* 3*; U6 1(N.C)*; U7 1(N.C)*; U8 1(N.C)*; U9 4(NC)* 7(NC)* 21(NC)* 30(RXD0)* 31(TXD0)* 32(NC)* 33(NC)* 34(NC)* 35(NC)*; USB1 3(SBU2)* 9(SBU1)*

## Notes on the sheets
sheet 1
- Input protection
- Buck
- LDO
- Note: CH213K is reverse voltage protection diode
  with over-curent protection with 1A limit
- PWR Indicator
- Switching Regulator 6.5V to 24V ->5V
- As an added bonus its low Ron(around 160mΩ)
  creates a RC low pass filter
  ~ 100kHz due to MLCC capacity derating from voltage
- Note:EN has internal pull-up
  Float=Enable
  Low=Disable
- 20K on RT= 1.09MHz switching freq
- As long as at 5V line stays above 4.5V all will work well
- USB Conenctor
- TPS Disable on USB Power
- Note: Remove 10K resistor (R9) if you dont want the USB plugging in to disable the VCC Power In
- WARNING: DO NOT use LONG USB CABLES to power the device.
- They use thin,long wires and will create a substatial voltage drop making the 5V supply line TOO LOW.
  If you MUST use a long USB cable remove R9 and power the module from 12V source via
  the PWR in and GND pins on the connector
- USB
- BackFeed Protection
- The lower limit on the 5V line is 4.5V due to the LDO dropout voltage and the CAN tranciver
  both needing 4.5V minimum to work correctly
- Measure between the 5V and GND test points on the board to verify voltage
- USB Protection
- You can measure USB voltage before protection diode on VBUS test point
sheet 2
- Connector
- Inputs
- ESD Clamp
- Outputs
sheet 3
- ESP32 C6
- JTAG Debug
- Optional Header ESD
- Indicator LED
- Mode Switch
- Note:
  Requires External Power
- Chassis CAN
- Haldex CAN
- Boot Keys
